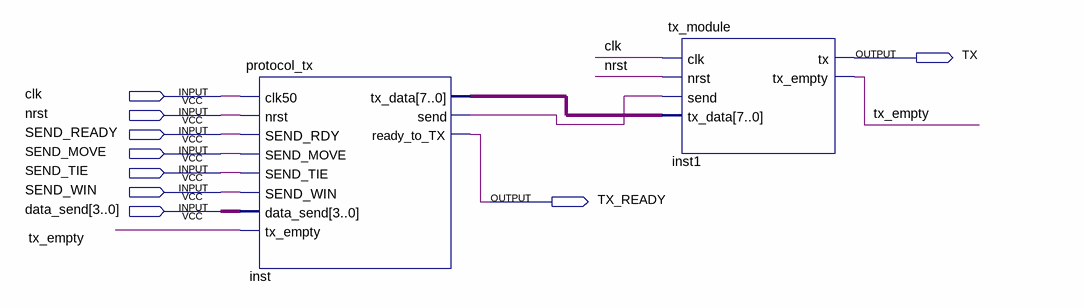
[diagram p0: schematic sheet]
// Quartus schematic TXmodule.bdf as structural Verilog: 2 symbols, 9 pins
module TXmodule (
  input  clk,
  input  nrst,
  input  SEND_READY,
  input  SEND_MOVE,
  input  SEND_TIE,
  input  SEND_WIN,
  input  [3:0] data_send,
  output TX,
  output TX_READY
);

  wire inst_send, tx_empty;
  wire [7:0] inst_tx_data;

  protocol_tx inst (
    .clk50(clk), .nrst(nrst), .SEND_RDY(SEND_READY), .SEND_MOVE(SEND_MOVE), .SEND_TIE(SEND_TIE),
    .SEND_WIN(SEND_WIN), .data_send(data_send), .tx_empty(tx_empty), .tx_data(inst_tx_data),
    .send(inst_send), .ready_to_TX(TX_READY));
  tx_module inst1 (.clk(clk), .nrst(nrst), .send(inst_send), .tx_data(inst_tx_data), .tx(TX), .tx_empty(tx_empty));
endmodule
